# EAGLE design SAM3U_Breakout (EAGLE 6.4)
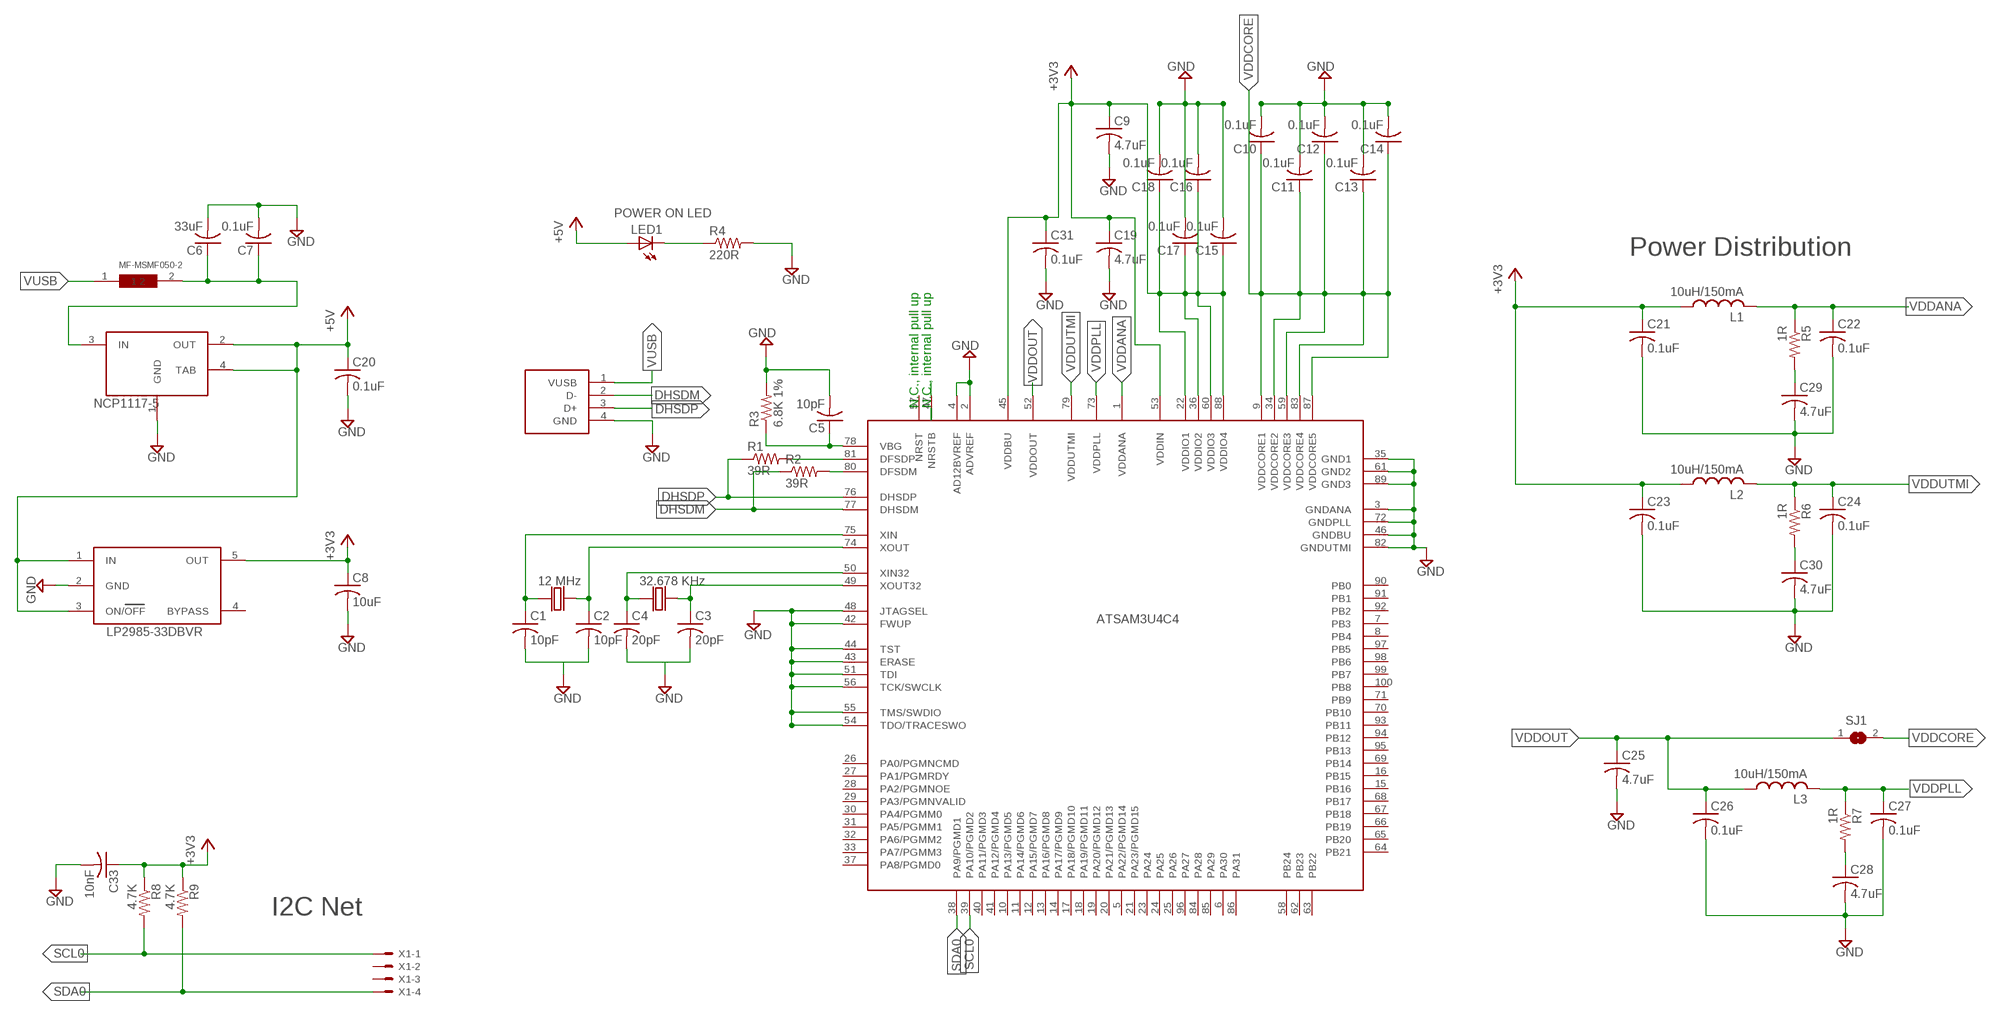
[diagram p0: schematic, sheet 1]

## Parts
C1  10pF  C-USC0402K  [C0402K]
C2  10pF  C-USC0402K  [C0402K]
C3  20pF  C-USC0402K  [C0402K]
C4  20pF  C-USC0402K  [C0402K]
C5  10pF  C-USC0402K  [C0402K]
C6  33uF  C-USC0402K  [C0402K]
C7  0.1uF  C-USC0402K  [C0402K]
C8  10uF  C-USC0402K  [C0402K]
C9  4.7uF  C-USC0402K  [C0402K]
C10  0.1uF  C-USC0402K  [C0402K]
C11  0.1uF  C-USC0402K  [C0402K]
C12  0.1uF  C-USC0402K  [C0402K]
C13  0.1uF  C-USC0402K  [C0402K]
C14  0.1uF  C-USC0402K  [C0402K]
C15  0.1uF  C-USC0402K  [C0402K]
C16  0.1uF  C-USC0402K  [C0402K]
C17  0.1uF  C-USC0402K  [C0402K]
C18  0.1uF  C-USC0402K  [C0402K]
C19  4.7uF  C-USC0402K  [C0402K]
C20  0.1uF  C-USC0402K  [C0402K]
C21  0.1uF  C-USC0402K  [C0402K]
C22  0.1uF  C-USC0402K  [C0402K]
C23  0.1uF  C-USC0402K  [C0402K]
C24  0.1uF  C-USC0402K  [C0402K]
C25  4.7uF  C-USC0402K  [C0402K]
C26  0.1uF  C-USC0402K  [C0402K]
C27  0.1uF  C-USC0402K  [C0402K]
C28  4.7uF  C-USC0402K  [C0402K]
C29  4.7uF  C-USC0402K  [C0402K]
C30  4.7uF  C-USC0402K  [C0402K]
C31  0.1uF  C-USC0402K  [C0402K]
C33  10nF  C-USC0402K  [C0402K]
L1  10uH/150mA  L-USL2012C  [L2012C]
L2  10uH/150mA  L-USL2012C  [L2012C]
L3  10uH/150mA  L-USL2012C  [L2012C]
LED1  LEDCHIP-LED0603  [CHIP-LED0603]
R1  39R  R-US_R0402  [R0402]
R2  39R  R-US_R0402  [R0402]
R3  6.8K 1%  R-US_R0402  [R0402]
R4  220R  R-US_R0402  [R0402]
R5  1R  R-US_R0402  [R0402]
R6  1R  R-US_R0402  [R0402]
R7  1R  R-US_R0402  [R0402]
R8  4.7K  R-US_R0402  [R0402]
R9  4.7K  R-US_R0402  [R0402]
SJ1  SJ  [SJ]
U$1  ATSAM3UC4-PA  [QFP50P1600X1600X160-100N]
U$2  USB_TYPE_A_KEYSTN  [USB_TYPE_PLUG_KSTN_PACK]
U$3  AVX_CRYSTAL_12MHZ  [AVX_CRYSTAL_12MHZ_PACK]
U$4  AVX_ST43_CRYSTAL_32768  [AVX_ST32_CRYSTAL_32768_PACK]
U$5  NCP1117-55V  [NCP1117-5-SOT]
U$6  MF-MSMF050-2  [MF-MSMF050-PACK]
U$7  LP2985-33DBVR5-PIN  [LP2985-33DBVR-SO]
X1  KK-156-4  [KK-156-4]

## Nets
+3V3: C8.1 C9.1 C15.1 C16.1 C17.1 C18.1 C19.1 C21.1 C23.1 C31.1 C33.1 L1.1 L2.1 R8.1 R9.1 U$1.22(VDDIO1) U$1.36(VDDIO2) U$1.45(VDDBU) U$1.53(VDDIN) U$1.60(VDDIO3) U$1.88(VDDIO4) U$7.5(OUT)
+5V: C20.1 LED1.A U$5.2(OUT) U$5.4(TAB) U$7.1(IN) U$7.3(ON/OFF)
DFSDM: R2.2 U$1.80(DFSDM)
DFSDP: R1.2 U$1.81(DFSDP)
DHSDM: R2.1 U$1.77(DHSDM) U$2.2(D-)
DHSDP: R1.1 U$1.76(DHSDP) U$2.3(D+)
GND: C1.2 C2.2 C3.2 C4.2 C5.2 C6.2 C7.2 C8.2 C9.2 C10.2 C11.2 C12.2 C13.2 C14.2 C15.2 C16.2 C17.2 C18.2 C19.2 C20.2 C21.2 C22.2 C23.2 C24.2 C25.2 C26.2 C27.2 C28.2 C29.2 C30.2 C31.2 C33.2 R3.2 R4.2 U$1.2(ADVREF) U$1.3(GNDANA) U$1.4(AD12BVREF) U$1.35(GND1) U$1.42(FWUP) U$1.43(ERASE) U$1.44(TST) U$1.46(GNDBU) U$1.48(JTAGSEL) U$1.51(TDI) U$1.54(TDO/TRACESWO) U$1.55(TMS/SWDIO) U$1.56(TCK/SWCLK) U$1.61(GND2) U$1.72(GNDPLL) U$1.82(GNDUTMI) U$1.89(GND3) U$2.4(GND) U$5.1(GND) U$7.2(GND)
N$1: C1.1 U$1.75(XIN) U$3.1
N$2: C2.1 U$1.74(XOUT) U$3.2
N$6: C4.1 U$1.50(XIN32) U$4.1
N$7: C3.1 U$1.49(XOUT32) U$4.2
N$8: C29.1 R5.2
N$9: LED1.C R4.1
N$11: C28.1 R7.2
N$12: C30.1 R6.2
NCP_IN: C6.1 C7.1 U$5.3(IN) U$6.2
NRSTB: U$1.47(NRSTB)
SCL0: R8.2 U$1.39(PA10/PGMD2) X1.1
SDA0: R9.2 U$1.38(PA9/PGMD1) X1.4
VBG: C5.1 R3.1 U$1.78(VBG)
VDDANA: C22.1 L1.2 R5.1 U$1.1(VDDANA)
VDDCORE: C10.1 C11.1 C12.1 C13.1 C14.1 SJ1.2 U$1.9(VDDCORE1) U$1.34(VDDCORE2) U$1.59(VDDCORE3) U$1.83(VDDCORE4) U$1.87(VDDCORE5)
VDDOUT: C25.1 C26.1 L3.1 SJ1.1 U$1.52(VDDOUT)
VDDPLL: C27.1 L3.2 R7.1 U$1.73(VDDPLL)
VDDUTMI: C24.1 L2.2 R6.1 U$1.79(VDDUTMI)
VUSB: U$2.1(VUSB) U$6.1
Unconnected: U$1.5(PA22/PGMD14) U$1.6(PA30) U$1.7(PB3) U$1.8(PB4) U$1.10(PA13/PGMD5) U$1.11(PA14/PGMD6) U$1.12(PA15/PGMD7) U$1.13(PA16/PGMD8) U$1.14(PA17/PGMD9) U$1.15(PB16) U$1.16(PB15) U$1.17(PA18/PGMD10) U$1.18(PA19/PGMD11) U$1.19(PA20/PGMD12) U$1.20(PA21/PGMD13) U$1.21(PA23/PGMD15) U$1.23(PA24) U$1.24(PA25) U$1.25(PA26) U$1.26(PA0/PGMNCMD) U$1.27(PA1/PGMRDY) U$1.28(PA2/PGMNOE) U$1.29(PA3/PGMNVALID) U$1.30(PA4/PGMM0) U$1.31(PA5/PGMM1) U$1.32(PA6/PGMM2) U$1.33(PA7/PGMM3) U$1.37(PA8/PGMD0) U$1.40(PA11/PGMD3) U$1.41(PA12/PGMD4) U$1.57(NRST) U$1.58(PB24) U$1.62(PB23) U$1.63(PB22) U$1.64(PB21) U$1.65(PB20) U$1.66(PB19) U$1.67(PB18) U$1.68(PB17) U$1.69(PB14) U$1.70(PB10) U$1.71(PB9) U$1.84(PA28) U$1.85(PA29) U$1.86(PA31) U$1.90(PB0) U$1.91(PB1) U$1.92(PB2) U$1.93(PB11) U$1.94(PB12) U$1.95(PB13) U$1.96(PA27) U$1.97(PB5) U$1.98(PB6) U$1.99(PB7) U$1.100(PB8) U$7.4(BYPASS) X1.2 X1.3

## Notes on the sheet
- POWER ON LED
- Power Distribution
- NCP1117-5 | N.C., internal pull up | N.C., internal pull up
- 12 MHz | 32.678 KHz
- LP2985-33DBVR
- I2C Net

## Library data of the parts
C1-C31 C33 = resistor:C-US: CAPACITOR, American symbol
L1-L3 = resistor:L-US: INDUCTOR, American symbol
LED1 = led:LED: LED OSRAM: - CHIPLED LG R971, LG N971, LY N971, LG Q971, LY Q971, LO R971, LY R971 LH N974, LH R974 LS Q976, LO Q976, LY Q976 LO Q996 - Hyper CHIPLED LW Q18S LB Q993, LB Q99A, LB R99A - SideLED LS A670, LO A670, LY A670, LG A670, LP A670 LB A673, LV A673, LT A673, LW A673 LH A674 LY A675 LS A676, LA A676, LO A676, LY A676, LW A676 LS A679, LY A679, LG A679 - Hyper Micro SIDELED® LS Y876, LA Y876, LO Y876, LY Y876 LT Y87S - SmartLED LW L88C, LW L88S LB L89C, LB L89S, LG L890 LS L89K, LO L89K, LY L89K LS L896, LA L896, LO L896, LY L896 - TOPLED LS T670, LO T670, LY T670, LG T670, LP T670 LSG T670, LSP T670, LSY T670, LOP T670, LYG T670 LG T671, LOG T671, LSG T671 LB T673, LV T673, LT T673, LW T673 LH T674 LS T676, LA T676, LO T676, LY T676, LB T676, LH T676, LSB T676, LW T676 LB T67C, LV T67C, LT T67C, LS T67K, LO T67K, LY T67K, LW E67C LS E67B, LA E67B, LO E67B, LY E67B, LB E67C, LV E67C, LT E67C LW T67C LS T679, LY T679, LG T679 LS T770, LO T770, LY T770, LG T770, LP T770 LB T773, LV T773, LT T773, LW T773 LH T774 LS E675, LA E675, LY E675, LS T675 LS T776, LA T776, LO T776, LY T776, LB T776 LHGB T686 LT T68C, LB T68C - Hyper Mini TOPLED® LB M676 - Mini TOPLED Santana® LG M470 LS M47K, LO M47K, LY M47K Source: http://www.osram.convergy.de LUXEON: - LUMILED® LXK2-PW12-R00, LXK2-PW12-S00, LXK2-PW14-U00, LXK2-PW14-V00 LXK2-PM12-R00, LXK2-PM12-S00, LXK2-PM14-U00 LXK2-PE12-Q00, LXK2-PE12-R00, LXK2-PE12-S00, LXK2-PE14-T00, LXK2-PE14-U00 LXK2-PB12-K00, LXK2-PB12-L00, LXK2-PB12-M00, LXK2-PB14-N00, LXK2-PB14-P00, LXK2-PB14-Q00 LXK2-PR12-L00, LXK2-PR12-M00, LXK2-PR14-Q00, LXK2-PR14-R00 LXK2-PD12-Q00, LXK2-PD12-R00, LXK2-PD12-S00 LXK2-PH12-R00, LXK2-PH12-S00 LXK2-PL12-P00, LXK2-PL12-Q00, LXK2-PL12-R00 Source: www.luxeon.com KINGBRIGHT: KA-3528ASYC Source: www.kingbright.com
R1 R2 R4 R8 R9 = rcl:R-US_: RESISTOR, American symbol
R3 R5-R7 = resistor:R-US_: RESISTOR, American symbol
SJ1 = jumper:SJ: SMD solder JUMPER
U$1 = Atmel_By_element14_Batch_1:ATSAM3UC4-PA: Pegasus Aero representation of ATSAM3U4C4
U$2 = ic_usb_typeA_connector_pa:USB_TYPE_A_KEYSTN: Pegasus Aero representation of USB type A plug from Keystone Electronics
U$3 = ic_crystal_pa:AVX_CRYSTAL_12MHZ: Pegasus Aero representation of AVX 12 Mhz crystal
U$4 = ic_crystal_pa:AVX_ST43_CRYSTAL_32768: Pegasus Aero representation of AVX crystal
U$5 = ic_voltage_reg_pa:NCP1117-5: Pegasus Aero representation of NCP-1117-5
U$6 = ic_mf-msmf050_pa:MF-MSMF050-2: Pegasus Aero representation of MF-MSMF050-2 Bourns resettable fuse
U$7 = ic_voltage_reg_pa:LP2985-33DBVR: Pegasus Aero representation of Texas Instruments LP2985-DBVR
X1 = con-molex:KK-156-4: KK 156 HEADER Source: http://www.molex.com/pdm_docs/sd/026604100_sd.pdf; OC_FARNELL: unknown; OC_NEWARK: unknown

## Board
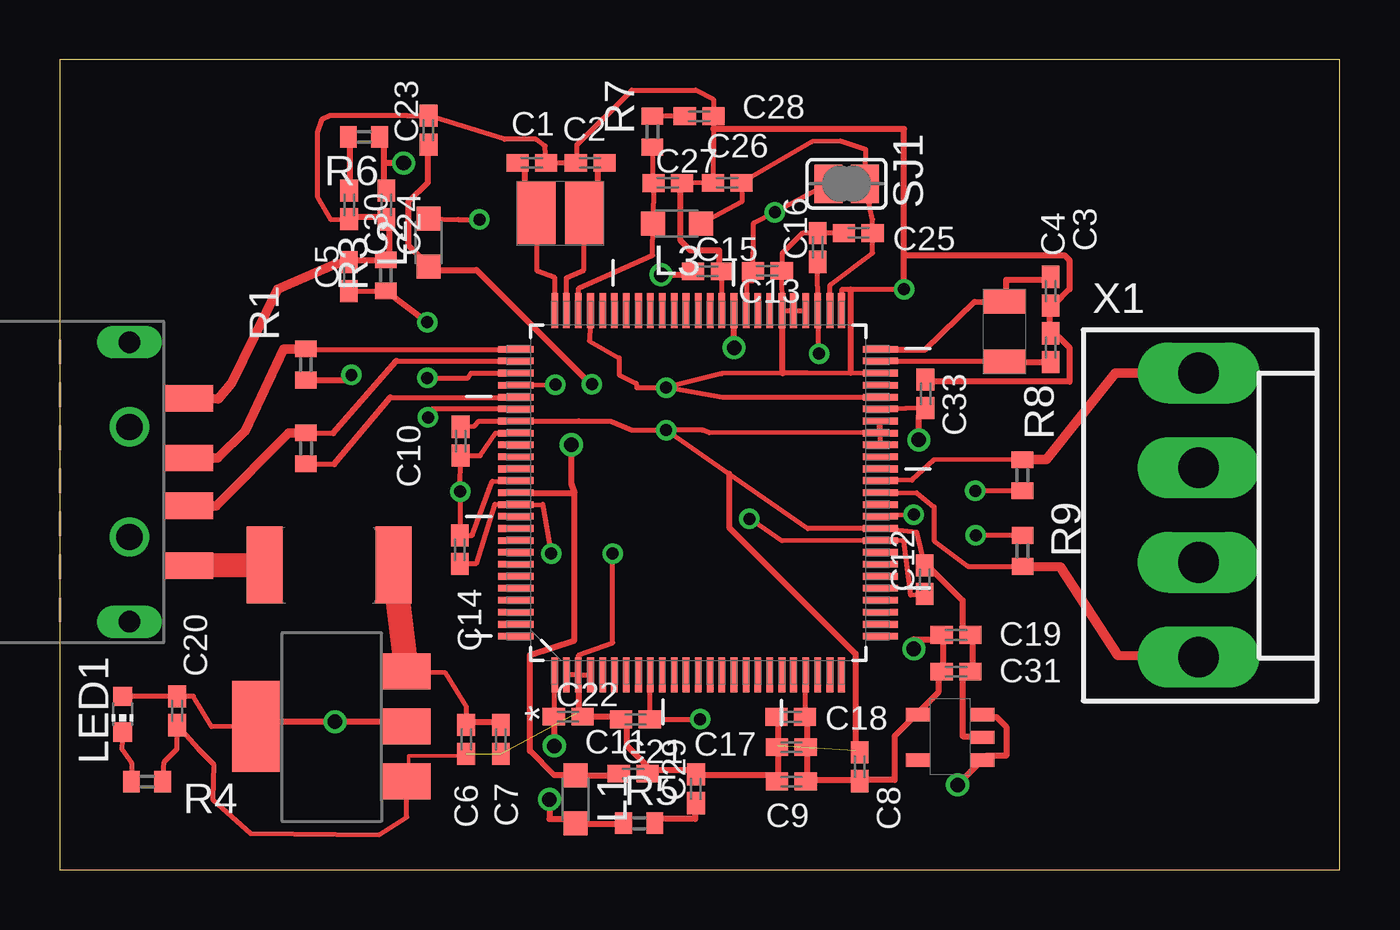
[diagram p1: board, top side]
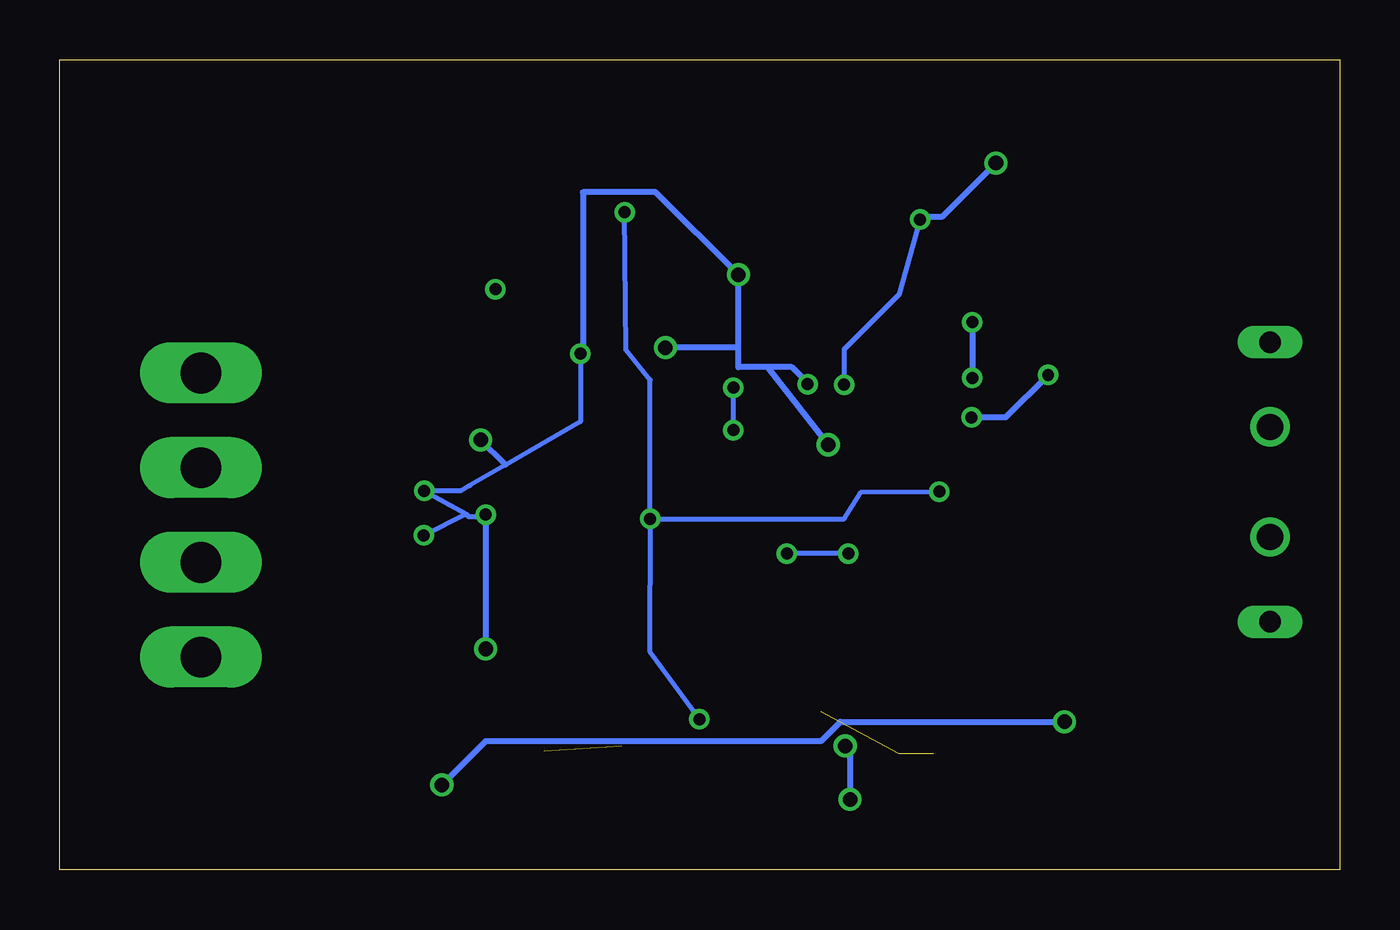
[diagram p2: board, bottom side, seen from below]

Size 53.52 x 33.88 mm. Coordinates in mm from the lower left corner, seen from the top.
Outline: 0,0 53.52,0 53.52,33.88 0,33.88 0,0
Copper layers (1*16): Top 0.0356mm / dielectric 1.5011mm / Bottom 0.0356mm
Design rules "LaenPCBOrder": minimum track width 6mil, minimum drill 13mil, track to track 6mil, track to pad 6mil, pad to pad 6mil, via to via 6mil, smd to smd 6mil, copper to edge 15mil, drill to drill 6mil, minimum pad ring 7mil, minimum via ring 7mil, stop-mask expansion 4mil, vias tented up to drill 0mil, thermal gap 10mil

### Footprints (pad centres in the part's own frame; a part is rotated, then mirrored left to right if it is on the bottom)
C0402K = smd 0.925 x 0.74: 1 -0.6,0; 2 0.6,0
L2012C = smd 1 x 1: 1 -1,0; 2 1,0
CHIP-LED0603 = smd 0.8 x 0.8: A 0,-0.75; C 0,0.75
R0402 = smd 0.7 x 0.9: 1 -0.65,0; 2 0.65,0
SJ = smd 1.168 x 1.6: 1 -0.762,0; 2 0.762,0
QFP50P1600X1600X160-100N = smd 1.473 x 0.279: 1 -7.62,5.994; 2 -7.62,5.512; 3 -7.62,5.004; 4 -7.62,4.496; 5 -7.62,3.988; 6 -7.62,3.505; 7 -7.62,2.997; 8 -7.62,2.489; 9 -7.62,2.007; 10 -7.62,1.499; 11 -7.62,0.991; 12 -7.62,0.508; 13 -7.62,0; 14 -7.62,-0.508; 15 -7.62,-0.991; 16 -7.62,-1.499; 17 -7.62,-2.007; 18 -7.62,-2.489; 19 -7.62,-2.997; 20 -7.62,-3.505; 21 -7.62,-3.988; 22 -7.62,-4.496; 23 -7.62,-5.004; 24 -7.62,-5.512; 25 -7.62,-5.994; 51 7.62,-5.994; 52 7.62,-5.512; 53 7.62,-5.004; 54 7.62,-4.496; 55 7.62,-3.988; 56 7.62,-3.505; 57 7.62,-2.997; 58 7.62,-2.489; 59 7.62,-2.007; 60 7.62,-1.499; 61 7.62,-0.991; 62 7.62,-0.508; 63 7.62,0; 64 7.62,0.508; 65 7.62,0.991; 66 7.62,1.499; 67 7.62,2.007; 68 7.62,2.489; 69 7.62,2.997; 70 7.62,3.505; 71 7.62,3.988; 72 7.62,4.496; 73 7.62,5.004; 74 7.62,5.512; 75 7.62,5.994 | smd 0.279 x 1.473: 26 -5.994,-7.62; 27 -5.512,-7.62; 28 -5.004,-7.62; 29 -4.496,-7.62; 30 -3.988,-7.62; 31 -3.505,-7.62; 32 -2.997,-7.62; 33 -2.489,-7.62; 34 -2.007,-7.62; 35 -1.499,-7.62; 36 -0.991,-7.62; 37 -0.508,-7.62; 38 0,-7.62; 39 0.508,-7.62; 40 0.991,-7.62; 41 1.499,-7.62; 42 2.007,-7.62; 43 2.489,-7.62; 44 2.997,-7.62; 45 3.505,-7.62; 46 3.988,-7.62; 47 4.496,-7.62; 48 5.004,-7.62; 49 5.512,-7.62; 50 5.994,-7.62; 76 5.994,7.62; 77 5.512,7.62; 78 5.004,7.62; 79 4.496,7.62; 80 3.988,7.62; 81 3.505,7.62; 82 2.997,7.62; 83 2.489,7.62; 84 2.007,7.62; 85 1.499,7.62; 86 0.991,7.62; 87 0.508,7.62; 88 0,7.62; 89 -0.508,7.62; 90 -0.991,7.62; 91 -1.499,7.62; 92 -2.007,7.62; 93 -2.489,7.62; 94 -2.997,7.62; 95 -3.505,7.62; 96 -3.988,7.62; 97 -4.496,7.62; 98 -5.004,7.62; 99 -5.512,7.62; 100 -5.994,7.62
USB_TYPE_PLUG_KSTN_PACK = smd 1.1 x 2: 1 -3.5,-1.05; 2 -1,-1.05; 3 1,-1.05; 4 3.5,-1.05 | drill 0.9 pad 1.25 long: P$1 -5.85,1.45; P$2 5.85,1.45 | drill 1.1 pad 1.25: P$3 -2.3,1.45; P$4 2.3,1.45
AVX_CRYSTAL_12MHZ_PACK = smd 1.6 x 2.6: 1 0.8,1.2; 2 2.8,1.2
AVX_ST32_CRYSTAL_32768_PACK = smd 1 x 1.8: 1 -1.31,0.43; 2 1.19,0.43
NCP1117-5-SOT = smd 1.5 x 2: 1 0,0; 2 2.3,0; 3 4.6,0 | smd 3.8 x 2: 4 2.3,6.3
MF-MSMF050-PACK = smd 1.5 x 3.2: 1 0,0; 2 5.4,0
LP2985-33DBVR-SO = smd 0.55 x 1: 1 0,0; 2 0.95,0; 3 1.9,0; 4 0,2.7; 5 1.9,2.7
KK-156-4 = drill 1.7 pad 2.184 long: 1 -5.94,0; 2 -1.98,0; 3 1.98,0; 4 5.94,0

### Placement (x,y rotation side)
C1  19.74,29.57 0 top
C2  22.17,29.57 180 top
C3  41.43,21.84 90 top
C4  41.43,24.21 270 top
C5  12.09,24.82 90 top
C6  16.99,5.46 270 top
C7  18.44,5.46 270 top
C8  33.45,4.32 90 top
C9  30.59,3.7 180 top
C10  16.76,17.93 90 top
C11  24.07,6.3 180 top
C12  36.17,12.14 90 top
C13  29.59,25.06 0 top
C14  16.73,13.39 270 top
C15  27.08,25.04 0 top
C16  31.69,26.03 90 top
C17  30.59,5.14 180 top
C18  30.56,6.4 180 top
C19  37.48,9.83 0 top
C20  4.91,6.66 270 top
C21  23.97,4.03 0 top
C22  21.25,6.41 0 top
C23  15.42,30.94 90 top
C24  13.65,27.81 270 top
C25  33.39,26.64 180 top
C26  27.91,28.74 180 top
C27  25.42,28.73 0 top
C28  26.73,31.52 0 top
C29  26.6,3.4 90 top
C30  12.1,27.81 270 top
C31  37.47,8.3 0 top
C33  36.2,19.91 90 top
L1  21.56,2.96 270 top
L2  15.42,26.23 90 top
L3  25.8,27.02 180 top
LED1  2.63,6.51 180 top
R1  10.29,21.14 270 top
R2  10.3,17.63 270 top
R3  13.64,24.87 90 top
R4  3.65,3.69 0 top
R5  24.23,1.95 0 top
R6  12.72,30.66 180 top
R7  24.78,30.88 90 top
R8  40.25,16.51 90 top
R9  40.25,13.34 270 top
SJ1  32.9,28.7 180 top
U$1  26.69,15.78 90 top
U$2  4.36,16.23 90 top
U$3  19.13,26.26 0 top
U$4  39.07,22.45 270 top
U$5  14.5,3.71 90 top
U$6  8.56,12.76 0 top
U$7  38.58,4.6 90 top
X1  47.62,14.84 270 top

### Tracks (layer width: path | path; a pad name or v marks a point on that pad's centre or on a via)
+3V3  (via drill 0.5, 0.61)
  Top 0.203: C33.1 35.38,19.3 U$1.45 | C18.1 31.19,6.4 U$1.22 | R8.1 38.33,15.85 | 38.33,15.85 v38.28,15.85 | v35.71,14.86 U$1.36 | R9.1 38.33,14 | 38.33,14 38.28,14 | v31.75,21.59 U$1.53 C16.1 | v38.3,14 38.33,14 | v38.28,15.85 38.33,15.85
  Top 0.254: C21.1 23.32,3.96 21.69,3.96 L1.1 21.49,3.96 20.68,3.96 19.66,4.98 19.66,8.99 21.51,9.6 21.51,15.75 | 21.51,15.75 19.25,15.75 U$1.88 | C18.1 31.24,6.4 31.24,5.18 C17.1 31.24,4.98 31.24,3.76 | 31.24,3.76 33.27,3.76 C8.1 33.48,3.76 34.9,3.76 34.9,5.59 35.71,6.4 U$7.5 35.92,6.6 36.73,7.42 36.73,8.23 C31.1 36.93,8.43 36.93,9.65 C19.1 36.73,9.65 35.71,9.65 v35.71,9.25 | 31.24,3.76 C9.1 | v22.25,20.32 22.1,20.42 17.42,25.1 15.6,25.1 L2.1 15.39,25.3 14.58,26.11 14.58,27.94 15.39,28.75 15.39,30.18 C23.1 | v25.15,24.89 26.36,24.89 C15.1 | v28.19,21.84 28.19,23.27 U$1.60 | v35.92,17.98 35.92,19 36.12,19.2 C33.1 | 21.51,15.75 21.39,16.15 v21.39,17.78
  Bottom 0.203: 36.53,14.88 v38.28,15.85 36.75,15.85 36.37,16.08 34.88,16.94 31.75,18.75 v31.75,21.59 | 36.53,14.88 36.45,14.81 36.45,14.78 35.79,14.78 v35.71,14.86 | v38.3,14 36.53,14.88
  Bottom 0.254: 25.15,21.84 25.15,21.03 23.93,21.03 | 25.15,21.84 v25.15,24.89 28.6,28.35 31.65,28.35 31.65,21.64 v31.75,21.59 | 23.93,21.03 22.91,21.03 22.3,20.42 v22.25,20.32 | 25.15,21.84 v28.19,21.84 | v35.92,17.98 34.9,16.97 34.88,16.94 | v35.71,14.86 v35.71,9.25 | 23.93,21.03 v21.39,17.78
+5V  (via drill 0.61)
  Top 0.203: U$5.4 6.35,5.99 5.59,7.26 C20.1 LED1.A
  Top 0.254: U$7.3 38.76,6.4 39.17,6.4 39.57,5.99 39.57,4.78 38.76,4.78 U$7.1 v37.54,3.56 | U$5.2 14.38,6.2 v11.51,6.2 8.28,6.2 U$5.4
  Bottom 0.254: v37.54,3.56 35.71,5.38 21.69,5.38 20.88,6.2 v11.51,6.2
DFSDM
  Top 0.203: R2.2 11.48,16.97 | 13.82,19.76 U$1.80
  Top 0.254: 11.48,16.97 13.82,19.76
DFSDP  (via drill 0.5)
  Top 0.203: U$1.81 15.58,19.28 v15.39,18.92 | 11.98,20.49 v12.19,20.7
  Top 0.254: R1.2 11.98,20.49
  Bottom 0.254: v12.19,20.7 13.97,18.92 v15.39,18.92
DHSDM
  Top 0.203: R2.1 10.32,18.26 11.43,18.26 | 14.07,21.29 U$1.77
  Top 0.254: 11.43,18.26 14.07,21.29
  Top 0.406: 5.42,15.21 U$2.2 6.54,15.23 9.58,18.26 10.28,18.26 R2.1
DHSDP
  Top 0.178: R1.1 10.3,21.77
  Top 0.203: 10.3,21.77 U$1.76
  Top 0.406: R1.1 9.37,21.79 8.1,19.1 7.75,18.36 6.6,17.22 U$2.3
GND  (via drill 0.5)  (3 unrouted)
  Top 0.152: C6.2 16.81,4.78 14.58,4.78 14.58,3.76 U$5.1
  Top 0.178: U$1.48 33.07,20.78 31.24,20.78 | U$1.35 34.59,14.28 34.59,14.3
  Top 0.203: U$1.4 U$1.3 U$1.2 | U$1.42 U$1.43 27.15,18.29 26.87,18.39 v25.35,18.39 | U$1.54 U$1.55 30.63,23.4 U$1.56 C13.2 30.2,25.08 30.2,25.78 31.05,26.63 C16.2 C25.2 | C12.2 35.84,14.12 U$1.35 31.27,14.27 27.99,16.56 v25.35,18.39 | R4.2 4.37,4.52 4.9,5.05 C20.2 5.79,5.05 6.43,4.42 6.4,2.95 7.98,1.52 13.36,1.47 14.5,2.21 U$5.1 | C27.2 C26.2 27.33,30.99 C28.2 27.33,32.23 26.59,32.61 23.93,32.61 21.61,30.3 21.61,29.61 C2.2 C1.2 20.29,30.28 19.91,30.56 18.59,30.56 C23.2 14.5,31.55 11.3,31.55 10.95,31.37 10.77,30.84 10.77,28.17 11.33,27.2 C30.2 | C10.2 17.35,18.57 17.53,18.77 U$1.82 21.69,18.78 23.04,18.77 23.93,18.39 v25.35,18.39 | U$1.72 22.15,22.12 23.39,21.41 23.39,20.7 24.11,20.35 24.13,20.17 v25.35,20.17 | 31.24,20.78 30.23,20.77 27.69,20.75 v25.35,20.17 | U$1.51 32.72,24.28 33.07,24.28 v35.31,24.28 | U$1.46 27.71,19.76 v25.35,20.17 | U$1.61 C15.2 | v20.55,13.23 20.19,15.29 U$1.89 18.19,15.29 17.4,12.8 C14.2 | 21.69,8.23 21.69,8.99 23.11,9.5 v23.11,13.23
  Top 0.254: C5.2 12.14,25.5 13.56,25.5 R3.2 13.77,25.7 13.77,27.13 C24.2 13.56,27.33 12.14,27.33 C30.2 | C27.2 25.96,28.55 25.96,26.31 26.36,25.91 27.58,25.91 27.58,25.1 C15.2 | C18.2 30.02,6.4 30.02,5.18 C17.2 30.02,4.98 30.02,3.96 | 30.02,3.96 30.02,3.76 C9.2 30.02,3.96 | 30.02,3.96 26.77,3.96 C29.2 26.57,4.17 24.74,4.17 C21.2 24.54,4.17 24.54,4.37 23.72,5.18 23.72,5.99 23.52,6.2 C11.2 23.32,6.4 21.89,6.4 C22.2 21.69,6.6 21.69,8.03 U$1.3 21.69,8.23 | C33.2 36.32,20.42 42.22,20.42 42.22,21.84 41.61,22.45 C3.2 41.4,22.45 41.4,23.47 C4.2 41.61,23.67 42.22,24.28 42.22,25.5 42.01,25.7 35.31,25.7 | U$7.2 38.56,5.59 37.74,5.59 37.74,8.03 37.95,8.23 C31.2 38.15,8.43 38.15,9.65 C19.2 37.95,9.86 37.74,10.06 37.74,11.28 36.32,12.7 C12.2 | U$1.55 30.63,23.47 30.63,23.4 | C8.2 33.27,4.98 33.27,9.04 27.99,14.33 27.99,16.56 | U$1.44 34.29,18.8 34.29,18.39 U$1.43 | U$1.56 30.23,23.27 30.23,20.83 30.23,20.77 | 33.07,20.78 33.07,24.28 | v35.31,24.28 35.31,25.7 | 35.31,25.7 35.31,30.99 27.38,30.99 27.33,30.99
  Top 0.406: U$2.4 6.63,19.69 7.19,20.37 9.12,24.28 11.48,25.32 C5.2
  Bottom 0.203: v25.35,18.39 v25.35,20.17 | v20.55,13.23 v23.11,13.23
N$1
  Top 0.203: U$1.75 20.7,24.77 19.96,25.04 U$3.1
  Top 0.254: C1.1 19.25,29.57 19.46,29.36 19.46,27.94 19.86,27.53 U$3.1
N$2
  Top 0.203: U$1.74 21.18,24.77 21.92,25.1 U$3.2
  Top 0.254: C2.1 22.71,29.57 22.5,29.36 22.5,27.94 22.1,27.53 U$3.2
N$6
  Top 0.254: U$1.50 36.2,21.77 38.25,23.75 U$4.1 39.57,23.88 39.57,24.69 41.4,24.69 C4.1
N$7
  Top 0.203: U$1.49 38.73,21.29 U$4.2
  Top 0.254: C3.1 41.4,21.23 39.57,21.23 U$4.2
N$8
  Top 0.254: R5.2 24.94,2.13 26.57,2.13 26.57,2.74 C29.1
N$9
  Top 0.203: LED1.C 2.59,5.05 3,4.47 R4.1
N$11
  Top 0.203: C28.1 R7.2
N$12
  Top 0.254: R6.2 12.14,30.58 12.14,28.55 C30.1
NCP_IN
  Top 0.203: U$5.3 16.1,8.26 16.99,6.83 C6.1
  Top 0.254: C7.1 18.44,6.2 17.02,6.2 C6.1
  Top 1.016: U$6.2 U$5.3
SCL0
  Top 0.203: R8.2 36.55,17.15 35.64,16.31 U$1.39
  Top 0.406: X1.1 44.15,20.78 41.25,17.17 R8.2
SDA0
  Top 0.203: U$1.38 35.84,15.77 36.55,15.19 36.55,13.77 37.97,12.7 R9.2
  Top 0.406: X1.4 44.25,8.97 41.83,12.67 R9.2
VBG  (via drill 0.5)
  Top 0.203: C5.1 R3.1 | v15.37,20.57 17.07,20.57 17.2,20.78 U$1.78
  Top 0.254: R3.1 v15.37,22.91
  Bottom 0.254: v15.37,22.91 v15.37,20.57
VDDANA  (via drill 0.61)
  Top 0.178: C22.1 20.7,6.41
  Top 0.203: 20.7,6.41 U$1.1
  Top 0.254: R5.1 23.52,1.93 21.69,1.93 L1.2 21.49,2.13 20.47,2.13 v20.47,2.95 | v20.68,5.18 20.68,6.4 C22.1
  Bottom 0.254: v20.47,2.95 20.47,5.18 v20.68,5.18
VDDCORE  (via drill 0.5)
  Top 0.178: U$1.59
  Top 0.203: C12.1 35.59,11.48 35.31,13.77 U$1.34 30.2,13.77 29.03,14.57 28.9,14.66 | C13.1 28.63,24.64 28.73,24.64 | U$1.59 28.68,24.08 28.73,24.08 28.73,24.64 | SJ1.2 v29.9,27.51 29.01,27.05 28.98,24.64 28.73,24.64 | v26.77,6.3 C11.1 U$1.9 | U$1.83 18.21,18.26 17.58,17.32 C10.1 v16.74,15.82 C14.1 17.25,14 18.08,16.26 U$1.87
  Top 0.254: 29.03,14.57 29.01,14.53 v28.83,14.68
  Bottom 0.203: v28.83,14.68 28.83,20.5 29.84,21.74 v29.9,27.51 | v28.83,14.68 28.85,9.14 v26.77,6.3 | v28.83,14.68 20.73,14.68 20.01,15.8 v16.74,15.82
VDDOUT
  Top 0.203: U$1.52 32.21,24.46 33.98,25.81 C25.1 33.98,27.2 SJ1.1 33.71,30.12 32.64,30.48 31.45,30.45 C26.1 28.52,27.94 L3.1
VDDPLL
  Top 0.203: U$1.73 21.69,24.33 24.79,25.7 L3.2 C27.1 R7.1
VDDUTMI  (via drill 0.5, 0.61)
  Top 0.203: L2.2 16.66,27.2 v17.55,27.2 | U$1.79 v20.73,20.29
  Top 0.254: 13.56,29.57 13.56,28.55 C24.1 | 13.56,29.57 13.56,30.58 R6.1 | v14.38,29.57 13.56,29.57
  Bottom 0.203: v17.55,27.2 18.44,24.05 20.73,21.77 v20.73,20.29
  Bottom 0.254: v14.38,29.57 16.61,27.33 17.42,27.33 v17.55,27.2
VUSB
  Top 1.016: U$2.1 U$6.1

### Text on the board
_tsilk: C2 | C28 | C23 | C1 | R7 | C26 | SJ1 | ATSAM3U4C4 Proto-B | R6 | C27 | C30 | C24 | C4 | C25 | C15 | L3 | C16 | C3 | R1 | L2 | C5 | R3 | C13 | X1 | C33 | R8 | C10 | R9 | C14 | C20 | C12 | LED1 | C19 | C31 | C22 | C18 | * | C11 | C17 | C21 | C6 | C7 | L1 | R5 | C29 | C9 | R4 | C8 | Pegasus Aero